# Altium schematic sheet Beambreak Array L - Emmiter.SchDoc
size 297 x 209 mm; CompanyName: Sainsbury Wellcome Centre; Organization: Innovation and Research FabLab; Address1: Sainsbury Wellcome Centre; Address2: 25 Howland Street; Address3: London; Address4: W1T 4JG; DocumentNumber: PIEUddmmyy; SheetNumber: 1; SheetTotal: 1; swcgroup: Innovation and Research; Org: Sainsbury Wellcome Centre; Add1: 25 Howland Street; Add2: London; Add3: W1T 4JG; WebAddress: www.sainsburywellcome.org; SheetSize: A4
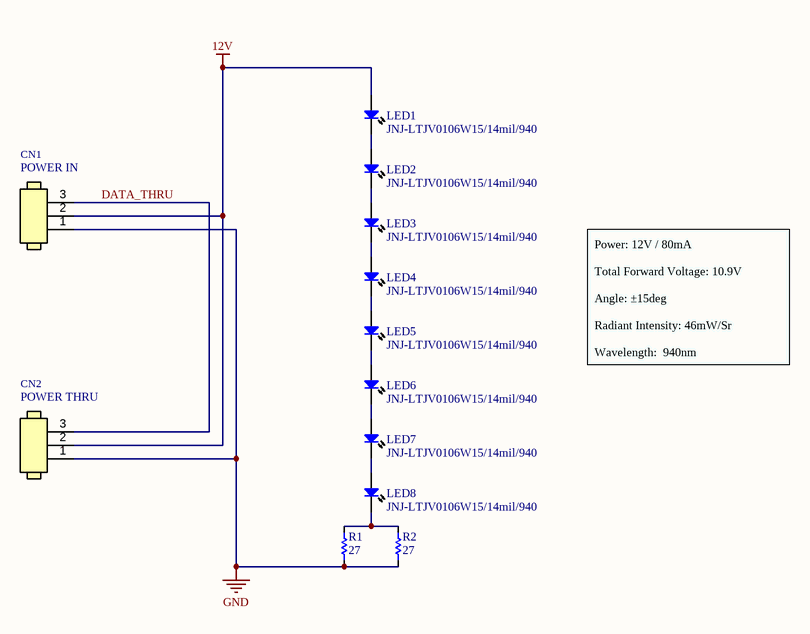
[diagram p0: Beambreak Array L - Emmiter.SchDoc]

## Parts
CN1  POWER IN  [EH_1X3P]
CN2  POWER THRU  [EH_1X3P]
LED1  PartNumber: JNJ-LTJV0106W15/14mil/940  [LED_CHIP_3528 - lens - S]  (hidden comment: LED2835_IR_940nm)
LED2  PartNumber: JNJ-LTJV0106W15/14mil/940  [LED_CHIP_3528 - lens - S]  (hidden comment: LED2835_IR_940nm)
LED3  PartNumber: JNJ-LTJV0106W15/14mil/940  [LED_CHIP_3528 - lens - S]  (hidden comment: LED2835_IR_940nm)
LED4  PartNumber: JNJ-LTJV0106W15/14mil/940  [LED_CHIP_3528 - lens - S]  (hidden comment: LED2835_IR_940nm)
LED5  PartNumber: JNJ-LTJV0106W15/14mil/940  [LED_CHIP_3528 - lens - S]  (hidden comment: LED2835_IR_940nm)
LED6  PartNumber: JNJ-LTJV0106W15/14mil/940  [LED_CHIP_3528 - lens - S]  (hidden comment: LED2835_IR_940nm)
LED7  PartNumber: JNJ-LTJV0106W15/14mil/940  [LED_CHIP_3528 - lens - S]  (hidden comment: LED2835_IR_940nm)
LED8  PartNumber: JNJ-LTJV0106W15/14mil/940  [LED_CHIP_3528 - lens - S]  (hidden comment: LED2835_IR_940nm)
R1  value 27  [RES_CHIP_0805]  (hidden comment: R0805-27R)
R2  value 27  [RES_CHIP_0805]  (hidden comment: R0805-27R)

## Nets
12V: CN1.2 CN2.2 LED1.2(A)
GND: CN1.1 CN2.1 R1.1 R2.1
DATA_THRU: CN1.3 CN2.3
NetLED1_1: LED1.1(C) LED2.2(A)
NetLED2_1: LED2.1(C) LED3.2(A)
NetLED3_1: LED3.1(C) LED4.2(A)
NetLED4_1: LED4.1(C) LED5.2(A)
NetLED5_1: LED5.1(C) LED6.2(A)
NetLED6_1: LED6.1(C) LED7.2(A)
NetLED7_1: LED7.1(C) LED8.2(A)
NetLED8_1: LED8.1(C) R1.2 R2.2

## Notes on the sheet
- Power: 12V / 80mA
  Total Forward Voltage: 10.9V
  Angle: ±15deg
  Radiant Intensity: 46mW/Sr
  Wavelength:  940nm
- FILE
- VARIANT
- DATE
- REVISION
- SHEET
- /
- PROJECT
- SIZE

## Library data of the parts
CN1 CN2 = CMP-370-0056-2: Connector Header, EH Series, 3 Position, 2.5mm, Through Hole, Press-Fit, Solder, Natural; PartNumber: B3B-EH-A(LF)(SN); Gender: Male; Current Rating: 3A; Number of Contacts: 3; Orientation: Straight; Mount: through hole; Number of Rows: 1; LCSC Part N.: C160259; Pitch: 2.5mm; Contact Material: Brass; Number of Positions: 3; Contact Plating: Tin
LED1-LED8 = CMP-520-0034-2: 240mW/sr 5V 100mA 1.4V~2.1V 925nm~955nm SMD2835-2P LED; Colour: IR; Wavelength: 940nm; Pick&PlaceFootprint: 2835; Forward Voltage: 1.4V; Forward Current: 100mA; LCSC Part N.: C7500105; Mount: Surface Mount
R1 R2 = CMP-633-0197-1: 125mW Thick Film Resistors 150V ±100ppm/℃ ±1% 0805 Chip Resistor; PartNumber: 0805W8F270JT5E; Number of Resistors: 1; Pick&PlaceFootprint: R0805; Mount: SMD; Voltage Rating: 150V; Power Rating: 125mW; Tolerance: 1%; Case/Package: 0805; LCSC Part N.: C17594